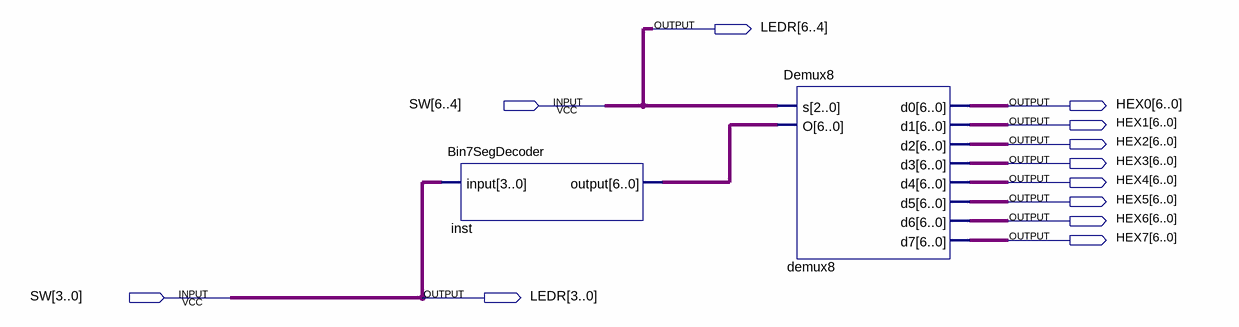
[diagram p0: schematic sheet]
// Quartus schematic DisplayDemo.bdf as structural Verilog: 2 symbols, 12 pins
module DisplayDemo (
  input  [6:0] SW,
  output [6:0] LEDR,
  output [6:0] HEX0,
  output [6:0] HEX1,
  output [6:0] HEX2,
  output [6:0] HEX3,
  output [6:0] HEX4,
  output [6:0] HEX5,
  output [6:0] HEX6,
  output [6:0] HEX7
);

  wire [6:0] inst_output;

  Bin7SegDecoder inst (.\input (SW[3:0]), .\output (inst_output));
  Demux8 demux8 (
    .s(SW[6:4]), .O(inst_output), .d0(HEX0), .d1(HEX1), .d2(HEX2), .d3(HEX3), .d4(HEX4), .d5(HEX5),
    .d6(HEX6), .d7(HEX7));

  assign LEDR = SW;
endmodule
